# EAGLE design HexaWall-v1.1 (EAGLE 9.6.2)
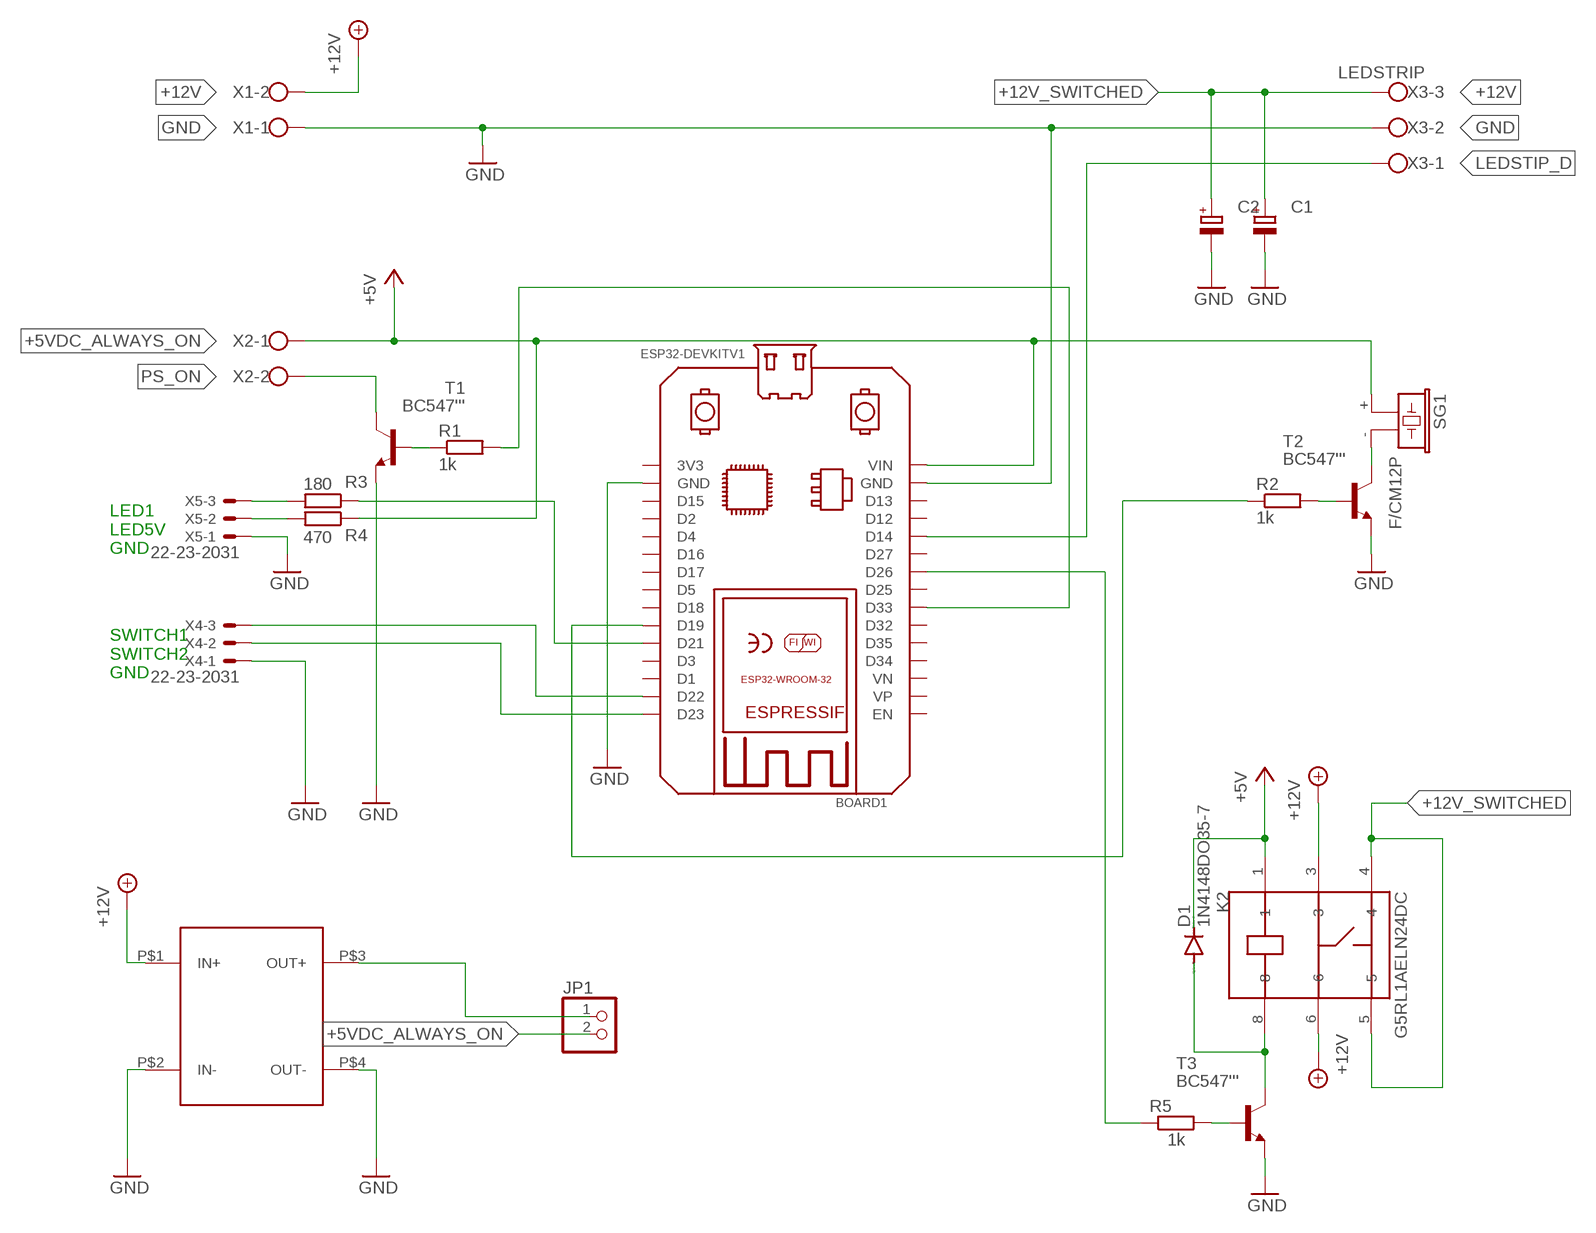
[diagram p0: schematic, sheet 1]

## Parts
BOARD1  ESP32DEVKITV1  [ESP32-DEVKITV1]
C1  CPOL-EUE7.5-16  [E7,5-16]
C2  CPOL-EUE7.5-16  [E7,5-16]
D1  1N4148DO35-7  [DO35-7]
JP1  PINHD-1X2  [1X02]
K2  G5RL1AELN24DC  [G5RL-1-E-HR]
PS$1  DC/DC_PCB  [DC/DC_PCB]
R1  1k  R-EU_0204/7  [0204/7]
R2  1k  R-EU_0204/7  [0204/7]
R3  180  R-EU_0204/7  [0204/7]
R4  470  R-EU_0204/7  [0204/7]
R5  1k  R-EU_0204/7  [0204/7]
SG1  F/CM12P  [F/CM12P]
T1  BC547'''  [TO92-CBE]
T2  BC547'''  [TO92-CBE]
T3  BC547'''  [TO92-CBE]
X1  W237-102  [W237-102]
X2  W237-102  [W237-102]
X3  LEDSTRIP  W237-103  [W237-103]
X4  22-23-2031  [22-23-2031]
X5  22-23-2031  [22-23-2031]

## Nets
+5VDC_ALWAYS_ON: BOARD1.VIN D1.C JP1.2 K2.1 R4.1 SG1.+ X2.1 ; supply symbol labelled +5V
+12V: K2.3 K2.6 PS$1.P$1(IN+) X1.2
+12V_SWITCHED: C1.+ C2.+ K2.4 K2.5 X3.3
GND: BOARD1.GND C1.- C2.- PS$1.P$2(IN-) PS$1.P$4(OUT-) T1.E T2.E T3.E X1.1 X3.2 X4.1 X5.1
LEDSTIP_D: BOARD1.D14 X3.1
N$1: R5.2 T3.B
N$2: R4.2 X5.2
N$3: R2.2 T2.B
N$4: BOARD1.D19 R2.1
N$5: R1.1 T1.B
N$6: BOARD1.D33 R1.2
N$7: R3.2 X5.3
N$8: D1.A K2.8 T3.C
N$9: BOARD1.D26 R5.1
N$10: SG1.- T2.C
N$11: BOARD1.GND@1(GND) ; supply symbol labelled GND
N$12: JP1.1 PS$1.P$3(OUT+)
N$13: BOARD1.D22 X4.3
N$14: BOARD1.D23 X4.2
N$15: BOARD1.D21 R3.1
PS_ON: T1.C X2.2
Unconnected: BOARD1.3V3 BOARD1.D1 BOARD1.D2 BOARD1.D3 BOARD1.D4 BOARD1.D5 BOARD1.D12 BOARD1.D13 BOARD1.D15 BOARD1.D16 BOARD1.D17 BOARD1.D18 BOARD1.D25 BOARD1.D27 BOARD1.D32 BOARD1.D34 BOARD1.D35 BOARD1.EN BOARD1.VN BOARD1.VP

## Notes on the sheet
- LED1
  LED5V
  GND
- SWITCH1
  SWITCH2
  GND

## Library data of the parts
BOARD1 = ESP32-DEVKITV1:ESP32DEVKITV1: https://github.com/shridattdudhat
C1 C2 = rcl:CPOL-EU: POLARIZED CAPACITOR, European symbol; SPICEPREFIX: C
D1 = diode:1N4148: DIODE high speed (Philips); SPICEPREFIX: D
JP1 = pinhead:PINHD-1X2: PIN HEADER
K2 = G5RL1AELN24DC:G5RL1AELN24DC: Electromechanical Relay 24VDC 1.086KOhm 16A SPST-NO (29x12.7x15.7)mm THT Power Relay; SPICEPREFIX: X
PS$1 = nntw.nl:DC/DC_PCB
R1-R5 = nntw.nl:R-EU_: RESISTOR, European symbol; SPICEPREFIX: R
SG1 = buzzer:F/CM12P: BUZZER Source: Buerklin; OC_FARNELL: unknown; OC_NEWARK: unknown
T1 T2 = nntw.nl:BC547: NPN TRANSISTOR
T3 = nntw.nl:BC547: NPN TRANSISTOR; SPICEPREFIX: J
X1 X2 = con-wago-500:W237-102: WAGO SCREW CLAMP; MPN: 237-102; OC_FARNELL: unknown; OC_NEWARK: 70K9898
X3 = con-wago-500:W237-103: WAGO SCREW CLAMP; MPN: 237-103; OC_FARNELL: unknown; OC_NEWARK: 18M7116
X4 X5 = con-molex:22-23-2031: .100" (2.54mm) Center Header - 3 Pin; MF: MOLEX; MPN: 22-23-2031; OC_FARNELL: 1462950; OC_NEWARK: 30C0862

## Board
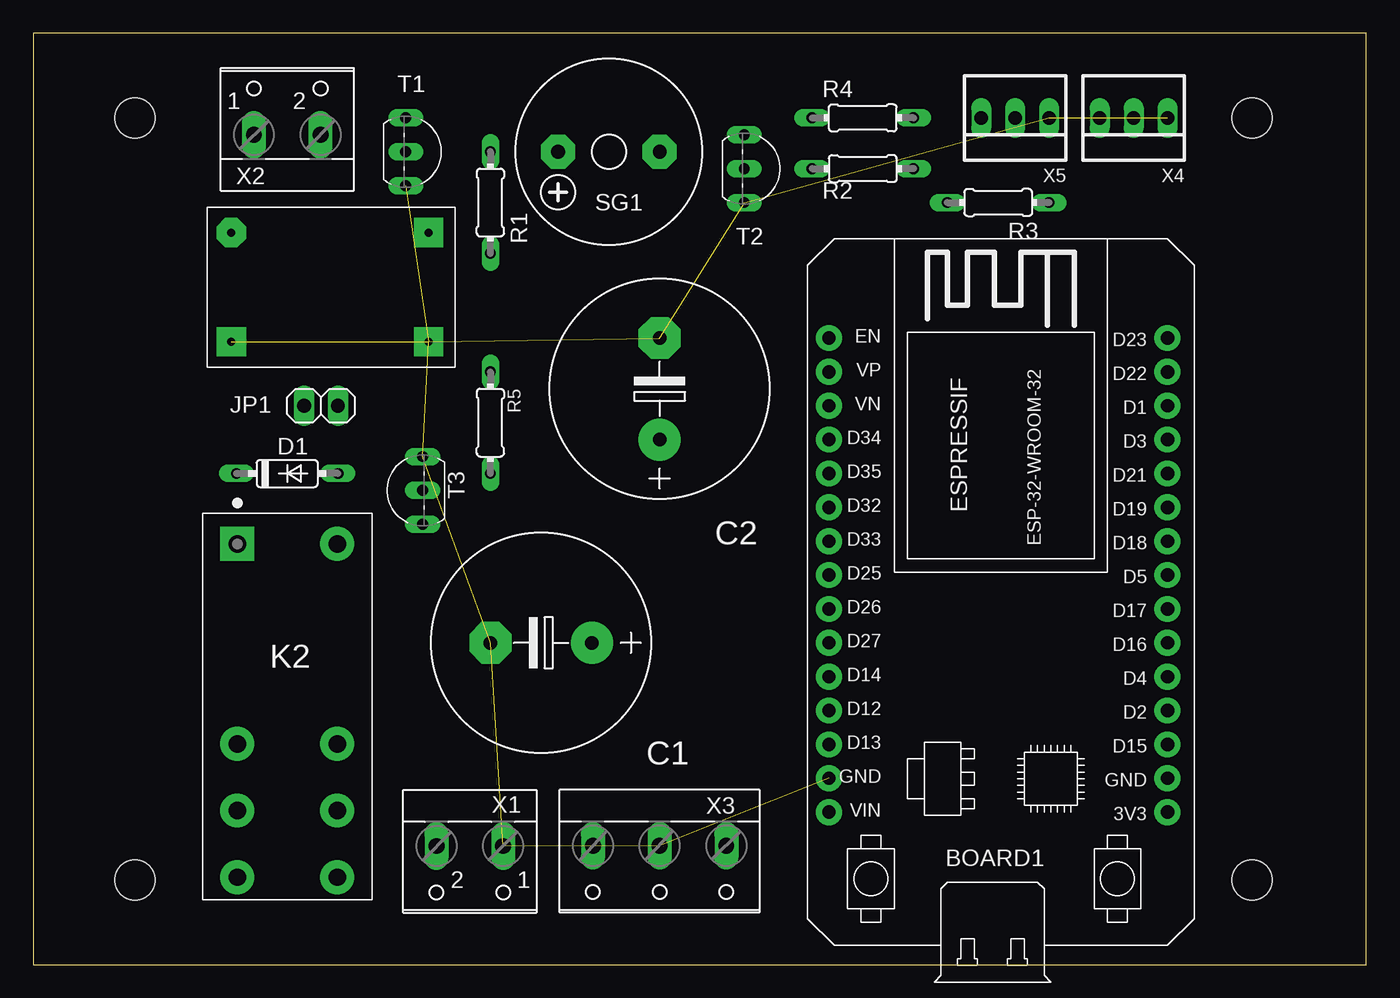
[diagram p1: board, top side]
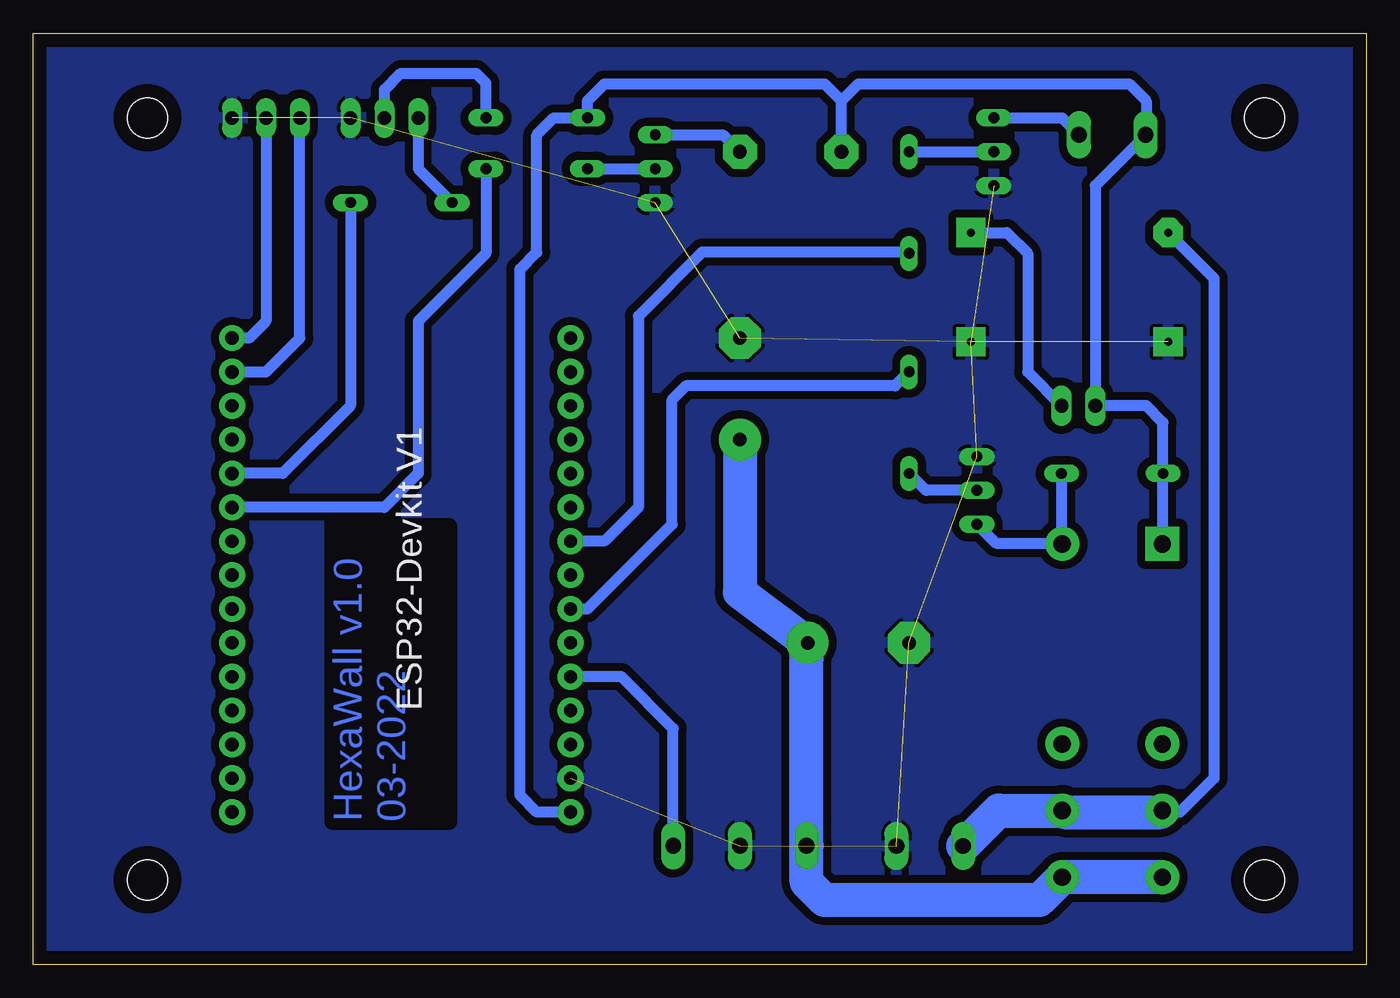
[diagram p2: board, bottom side, seen from below]

Size 100 x 69.84 mm. Coordinates in mm from the lower left corner, seen from the top.
Outline: 0,0 100,0 100,69.84 0,69.84 0,0
Copper layers (1*16): Top 0.035mm / dielectric 1.5mm / Bottom 0.035mm
Design rules "default": minimum track width 6mil, minimum drill 0.35mm, track to track 6mil, track to pad 6mil, pad to pad 6mil, via to via 6mil, smd to smd 6mil, copper to edge 40mil, drill to drill 6mil, minimum pad ring 10mil, minimum via ring 8mil, stop-mask expansion 4mil, vias tented up to drill 0mil, thermal gap 10mil
Holes 3 mm at 7.62,6.35 7.62,63.5 91.44,63.5 91.44,6.35

### Footprints (pad centres in the part's own frame; a part is rotated, then mirrored left to right if it is on the bottom)
ESP32-DEVKITV1 = drill 1 pad 1.93: 3V3 0,0; D1 30.48,0; D2 7.62,0; D3 27.94,0; D4 10.16,0; D5 17.78,0; D12 7.62,25.4; D13 5.08,25.4; D14 10.16,25.4; D15 5.08,0; D16 12.7,0; D17 15.24,0; D18 20.32,0; D19 22.86,0; D21 25.4,0; D22 33.02,0; D23 35.56,0; D25 17.78,25.4; D26 15.24,25.4; D27 12.7,25.4; D32 22.86,25.4; D33 20.32,25.4; D34 27.94,25.4; D35 25.4,25.4; EN 35.56,25.4; GND 2.54,25.4; GND@1 2.54,0; VIN 0,25.4; VN 30.48,25.4; VP 33.02,25.4
E7,5-16 = drill 1.016 pad 3.15: + -3.81,0 | drill 1.016 pad 3.15 octagon: - 3.81,0
DO35-7 = drill 0.813 long: A 3.81,0; C -3.81,0
1X02 = drill 1.016 long: 1 -1.27,0; 2 1.27,0
G5RL-1-E-HR = drill 1.3 pad 2.54 square: 1 -12.5,-3.75 | drill 1.3 pad 2.54: 2 2.5,-3.75; 3 7.5,-3.75; 4 12.5,-3.75; 5 12.5,3.75; 6 7.5,3.75; 7 2.5,3.75; 8 -12.5,3.75
DC/DC_PCB = drill 0.6 pad 2.184 octagon: P$1 -8,4.1 | drill 0.6 pad 2.184 square: P$2 -8,-4.1; P$3 6.8,4.1; P$4 6.8,-4.1
0204/7 = drill 0.813 long: 1 -3.81,0; 2 3.81,0
F/CM12P = drill 1.016 pad 2.54 octagon: + 3.81,0; - -3.81,0
TO92-CBE = drill 0.813 long: B 0,0; C -2.54,0; E 2.54,0
W237-102 = drill 1.194 long: 1 -2.5,-1.27; 2 2.5,-1.27
W237-103 = drill 1.194 long: 1 -5,-1.29; 2 0,-1.29; 3 5,-1.29
22-23-2031 = drill 1 long: 1 -2.54,0; 2 0,0; 3 2.54,0

### Placement (x,y rotation side)
BOARD1  85.09,11.43 90 top
C1  38.1,24.13 180 top
C2  46.99,43.18 90 top
D1  19.05,36.83 0 top
DRILEGEND  [DRILEGEND]  -2.95,-10.57 0 top  (outside the outline)
JP1  21.59,41.91 180 top
K2  19.05,19.05 270 top
PS$1  22.86,50.8 0 top
R1  34.29,57.15 270 top
R2  62.23,59.69 180 top
R3  72.39,57.15 180 top
R4  62.23,63.5 0 top
R5  34.29,40.64 270 top
SG1  43.18,60.96 180 top
T1  27.94,60.96 270 top
T2  53.34,59.69 270 top
T3  29.21,35.56 90 top
X1  32.75,7.62 180 top
X2  19.05,63.5 0 top
X3  46.99,7.62 180 top
X4  82.55,63.5 180 top
X5  73.66,63.5 180 top

### Tracks (layer width: path | path; a pad name or v marks a point on that pad's centre or on a via)
+5VDC_ALWAYS_ON
  Bottom 0.813: K2.1 15.24,31.61 D1.C 15.24,40.64 16.51,41.91 JP1.2 20.32,58.42 16.55,62.19 X2.1 16.51,62.27 16.51,64.77 17.78,66.04 38.1,66.04 39.37,64.77 | SG1.+ 39.37,64.77 | BOARD1.VIN 62.23,11.43 63.5,12.7 63.5,52.15 62.23,53.42 62.23,62.23 60.96,63.5 R4.1 58.42,64.77 57.15,66.04 40.64,66.04 39.37,64.77
+12V
  Bottom 0.813: PS$1.P$1 11.43,51.47 11.43,13.97 13.97,11.43 15.42,11.43
  Bottom 2.54: K2.3 15.42,11.43 22.68,11.43 K2.6 27.59,11.55 X1.2
+12V_SWITCHED
  Bottom 2.54: C2.+ 46.99,27.94 C1.+ 41.99,22.94 X3.3 41.99,6.18 40.64,4.83 24.52,4.83 K2.5 K2.4
GND  (11 unrouted)
  pour Bottom (isolate 0.61): -2.54,71.12 105.41,71.12 105.41,-6.35 -2.54,-6.35
LEDSTIP_D
  Bottom 0.813: X3.1 51.99,17.7 55.88,21.59 BOARD1.D14
N$1
  Bottom 0.813: T3.B 33.02,35.56 R5.2
N$2
  Bottom 0.813: X5.2 73.66,65.61 72.43,66.84 66.77,66.84 66.04,66.11 R4.2
N$3
  Bottom 0.813: R2.2 T2.B
N$4
  Bottom 0.813: BOARD1.D19 73.66,34.29 71.12,36.83 71.12,48.26 66.04,53.34 R2.1
N$5
  Bottom 0.813: R1.1 T1.B
N$6
  Bottom 0.813: R1.2 34.4,53.45 49.8,53.45 54.61,48.64 54.61,34.29 57.15,31.75 BOARD1.D33
N$7
  Bottom 0.813: X5.3 71.12,59.69 R3.2
N$8
  Bottom 0.813: D1.A 22.86,31.61 | 22.86,31.61 K2.8 | T3.C 27.8,31.61 22.86,31.61
N$9
  Bottom 0.813: R5.1 35.34,43.4 51.04,43.4 52.07,42.37 52.07,33.02 58.42,26.67 BOARD1.D26
N$10
  Bottom 0.813: T2.C 48.26,62.23 SG1.-
N$12
  Bottom 0.813: PS$1.P$3 26.96,54.9 25.4,53.34 25.4,44.45 JP1.1
N$13
  Bottom 0.813: BOARD1.D22 82.55,44.45 80.01,46.99 X4.3
N$14
  Bottom 0.813: BOARD1.D23 83.82,46.99 82.55,48.26 X4.2
N$15
  Bottom 0.813: R3.1 76.2,41.91 81.28,36.83 BOARD1.D21
PS_ON
  Bottom 0.813: T1.C 22.82,63.5 X2.2

### Text on the board
Bottom: HexaWall v1.0 / 03-2022
tDocu: +5V | PS_ON | GND | +12V / IN | GND | +12V / SWITCHED | DATA
DrillLegend: LAYER-STACK
DrillLegend_01-16: 01-16
DrillLegend_01-20: 01-20